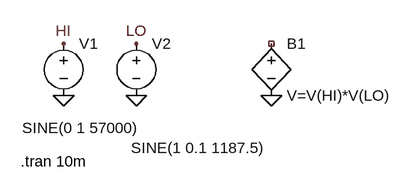
[diagram p0: schematic modulation.asc]
modulation.asc, the LTspice schematic file:
Version 4
SHEET 1 880 680
FLAG -112 192 0
FLAG 0 192 0
FLAG -112 112 HI
FLAG 0 112 LO
FLAG 208 192 0
SYMBOL bv 208 96 R0
SYMATTR InstName B1
SYMATTR Value V=V(HI)*V(LO)
SYMBOL voltage -112 96 R0
WINDOW 3 -64 146 Left 2
WINDOW 123 0 0 Left 2
WINDOW 39 0 0 Left 2
SYMATTR InstName V1
SYMATTR Value SINE(0 1 57000)
SYMBOL voltage 0 96 R0
WINDOW 3 -8 177 Left 2
WINDOW 123 0 0 Left 2
WINDOW 39 0 0 Left 2
SYMATTR InstName V2
SYMATTR Value SINE(1 0.1 1187.5)
TEXT -178 294 Left 2 !.tran 10m

The netlist it stands for:
* modulation.asc
B1 NC_01 0 V=V(HI)*V(LO)
V1 HI 0 SINE(0 1 57000)
V2 LO 0 SINE(1 0.1 1187.5)
.tran 10m
.backanno
.end